# Altium schematic sheet Waistband_motorDrivers.SchDoc
size A; SheetNumber: 2; SheetTotal: 5
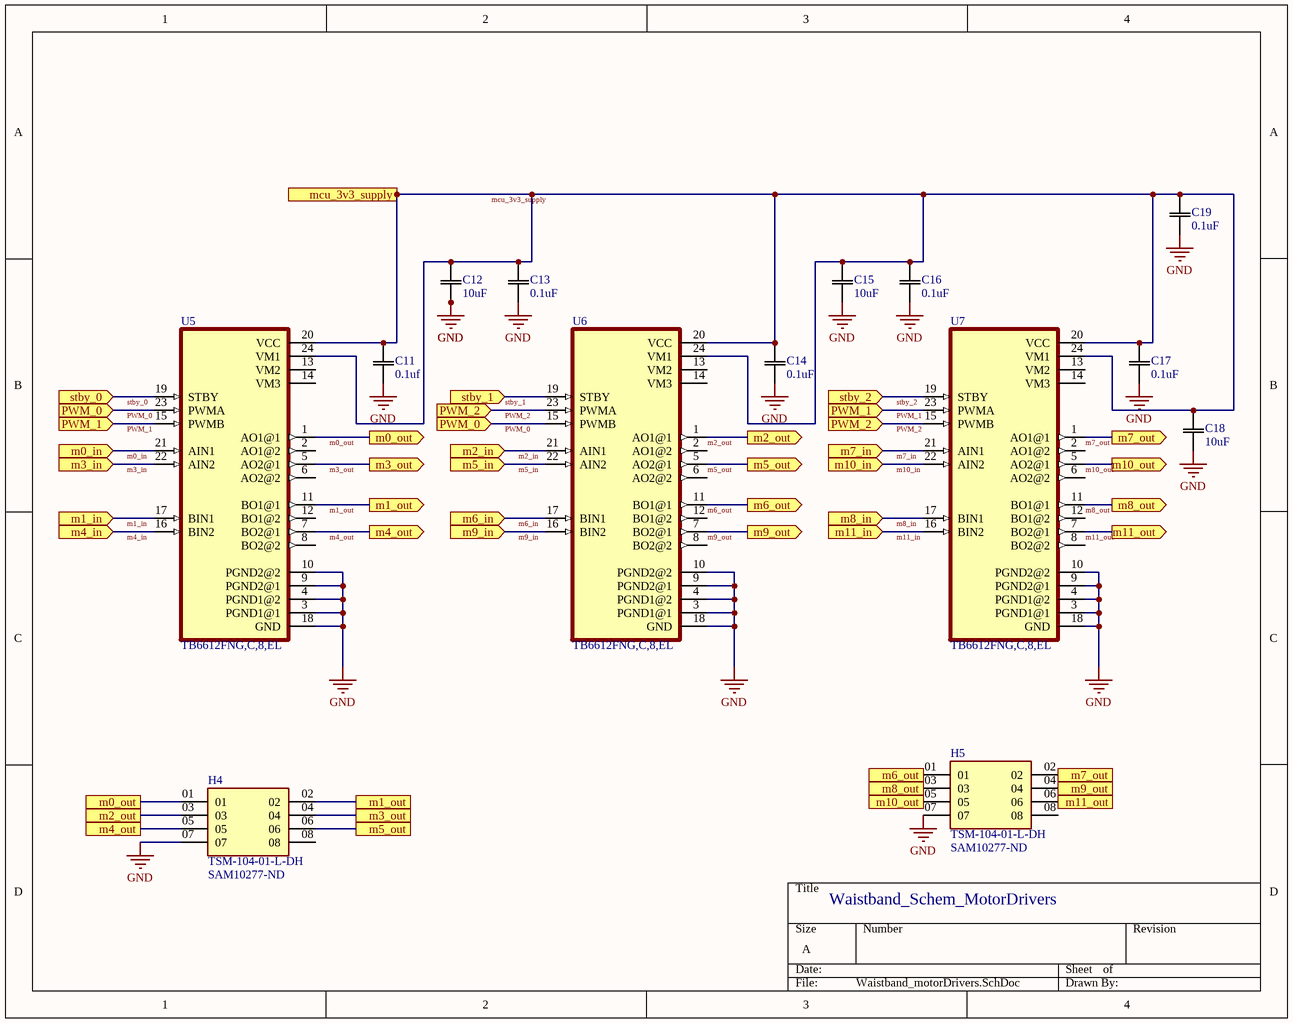
[diagram p0: Waistband_motorDrivers.SchDoc]

## Parts
C11  0.1uf  [Res 0805 1k]
C12  10uF  [C10uF]
C13  0.1uF  [Res 0805 1k]
C14  0.1uF  [Res 0805 1k]
C15  10uF  [C10uF]
C16  0.1uF  [Res 0805 1k]
C17  0.1uF  [Res 0805 1k]
C18  10uF  [C10uF]
C19  0.1uF  [Res 0805 1k]
H4  TSM-104-01-L-DH  [SAM10277-ND]
H5  TSM-104-01-L-DH  [SAM10277-ND]
U5  TB6612FNG,C,8,EL  [motorDriver_pcb]
U6  TB6612FNG,C,8,EL  [motorDriver_pcb]
U7  TB6612FNG,C,8,EL  [motorDriver_pcb]

## Ports
m0_in (in), m0_out, m0_out (out), m1_in (in), m1_out, m1_out (out), m2_in (in), m2_out, m2_out (out), m3_in (in), m3_out, m3_out (out), m4_in (in), m4_out, m4_out (out), m5_in (in), m5_out, m5_out (out), m6_in (in), m6_out, m6_out (out), m7_in (in), m7_out, m7_out (out), m8_in (in), m8_out, m8_out (out), m9_in (in), m9_out, m9_out (out), m10_in (in), m10_out, m10_out (out), m11_in (in), m11_out, m11_out (out), mcu_3v3_supply, PWM_0 (in), PWM_1 (in), PWM_2 (in), stby_0 (in), stby_1 (in), stby_2 (in)

## Nets
GND: C11.1 C12.1 C13.1 C14.1 C15.1 C16.1 C17.1 C18.1 C19.1 H4.07 H5.07 U5.3(PGND1@1) U5.4(PGND1@2) U5.9(PGND2@1) U5.10(PGND2@2) U5.18(GND) U6.3(PGND1@1) U6.4(PGND1@2) U6.9(PGND2@1) U6.10(PGND2@2) U6.18(GND) U7.3(PGND1@1) U7.4(PGND1@2) U7.9(PGND2@1) U7.10(PGND2@2) U7.18(GND)
m0_in: U5.21(AIN1) ; port m0_in
m0_out: H4.01 U5.1(AO1@1) ; port m0_out
m1_in: U5.17(BIN1) ; port m1_in
m1_out: H4.02 U5.11(BO1@1) ; port m1_out
m2_in: U6.21(AIN1) ; port m2_in
m2_out: H4.03 U6.1(AO1@1) ; port m2_out
m3_in: U5.22(AIN2) ; port m3_in
m3_out: H4.04 U5.5(AO2@1) ; port m3_out
m4_in: U5.16(BIN2) ; port m4_in
m4_out: H4.05 U5.7(BO2@1) ; port m4_out
m5_in: U6.22(AIN2) ; port m5_in
m5_out: H4.06 U6.5(AO2@1) ; port m5_out
m6_in: U6.17(BIN1) ; port m6_in
m6_out: H5.01 U6.11(BO1@1) ; port m6_out
m7_in: U7.21(AIN1) ; port m7_in
m7_out: H5.02 U7.1(AO1@1) ; port m7_out
m8_in: U7.17(BIN1) ; port m8_in
m8_out: H5.03 U7.11(BO1@1) ; port m8_out
m9_in: U6.16(BIN2) ; port m9_in
m9_out: H5.04 U6.7(BO2@1) ; port m9_out
m10_in: U7.22(AIN2) ; port m10_in
m10_out: H5.05 U7.5(AO2@1) ; port m10_out
m11_in: U7.16(BIN2) ; port m11_in
m11_out: H5.06 U7.7(BO2@1) ; port m11_out
mcu_3v3_supply: C11.2 C12.2 C13.2 C14.2 C15.2 C16.2 C17.2 C18.2 C19.2 U5.20(VCC) U5.24(VM1) U6.20(VCC) U6.24(VM1) U7.20(VCC) U7.24(VM1) ; port mcu_3v3_supply
PWM_0: U5.23(PWMA) U6.15(PWMB) ; port PWM_0
PWM_1: U5.15(PWMB) U7.23(PWMA) ; port PWM_1
PWM_2: U6.23(PWMA) U7.15(PWMB) ; port PWM_2
stby_0: U5.19(STBY) ; port stby_0
stby_1: U6.19(STBY) ; port stby_1
stby_2: U7.19(STBY) ; port stby_2

Not connected (* = marked no-connect by the designer): H4 08; H5 08; U5 2(AO1@2) 6(AO2@2) 8(BO2@2) 12(BO1@2) 13(VM2) 14(VM3); U6 2(AO1@2) 6(AO2@2) 8(BO2@2) 12(BO1@2) 13(VM2) 14(VM3); U7 2(AO1@2) 6(AO2@2) 8(BO2@2) 12(BO1@2) 13(VM2) 14(VM3)

## Notes on the sheet
- Waistband_Schem_MotorDrivers

## Library data of the parts
C11 C13 C14 C16 C17 C19 = C0805C104M5UACTU: Cap Ceramic 0.1uF 50V Z5U 20% SMD 0805 85C Paper T/R; Manufacturer: KEMET; Capacitance: 100nF; Dissipation Factor: 4%; Supplier 1: Digi-Key; Manufacturer Part Number: C0805C104M5UACTU; RoHS: Yes; Category: Ceramic Capacitors; Stock 1: 106; Pricing 1: 1=0.18000, 10=0.12700, 50=0.07220, 100=0.05980, 500=0.04194, 1000=0.03472 (USD); Mount: Surface Mount,PCB; Case/Package: 0805; Number of Pins: 2; Case Code (Imperial): 0805; Case Code (Metric): 2012; Dielectric Material: Ceramic; Contact Plating: Tin,Matte; Min Operating Temperature: 10°C; Max Operating Temperature: 85°C; Tolerance: 20%; Voltage Rating: 50V; Packaging: Tape and Reel; Package Quantity: 1; Voltage Rating (DC): 50V; Dielectric: Z5U; Termination: SMD/SMT; Series: C; Voltage: 50V; Construction: Flat; Length: 2mm; Width: 1.2mm; Height: 0.78mm; Depth: 1.25mm; Thickness: 0.035inch; Lead Pitch: 0.75mm; Radiation Hardening: No; RoHS Compliant: Yes; REACH SVHC: No SVHC; Lead Free: Lead Free; ComponentLink1URL: https://datasheet.ciiva.com/18193/getdatasheetpartid-89715-18193450.pdf?src-supplier=Verical; ComponentLink1Description: https://datasheet.ciiva.com/18193/getdatasheetpartid-89715-18193450.pdf?src-supplier=Verical; ComponentLink2URL: https://datasheet.ciiva.com/26847/getdatasheetpartid-314452-26847798.pdf?src-supplier=Verical; ComponentLink2Description: https://datasheet.ciiva.com/26847/getdatasheetpartid-314452-26847798.pdf?src-supplier=Verical; ComponentLink3URL: https://datasheet.ciiva.com/7842/kem-c1004-z5u-smd-7842541.pdf?src-supplier=Element14; ComponentLink3Description: https://datasheet.ciiva.com/7842/kem-c1004-z5u-smd-7842541.pdf?src-supplier=Element14; Supplier Part Number 1: 399-C0805C104M5UAC7800CT-ND
C12 C15 C18 = CL21A106KOQNNNE: Ceramic capacitor SMD-0805 10000nF (10uF) /16V X5R# K +-10% Samsung , RoHS/4000pcs/; Tolerance: 10%; Voltage Rating: 16V; Dielectric: X7R; Supplier 1: Digi-Key; Supplier Part Number 1: 1276-1096-1-ND; Manufacturer: Samsung; Manufacturer Part Number: CL21A106KOQNNNE; RoHS: Yes; Category: Ceramic Capacitors; Stock 1: 250843; Pricing 1: 1=0.11000, 10=0.08100, 50=0.04400, 100=0.03600, 500=0.02568, 1000=0.02018 (USD); Mount: Surface Mount; Case/Package: 0805; Case Code (Metric): 2012; Case Code (Imperial): 0805; Min Operating Temperature: -55°C; Max Operating Temperature: 85°C; Package Quantity: 1; Packaging: Tape and Reel; Capacitance: 10uF; Voltage Rating (DC): 16V; Voltage: 16V; Series: CL; Construction: Flat; Length: 2mm; Width: 0.049inch; Height: 1.25mm; Thickness: 0.055inch; Depth: 1.25mm; Radiation Hardening: No; Lead Free: Lead Free; RoHS Compliant: Yes; ComponentLink1URL: https://datasheet.ciiva.com/25798/cl21a106koqnnne-25798133.pdf?src-supplier=Digi-Key; ComponentLink1Description: https://datasheet.ciiva.com/25798/cl21a106koqnnne-25798133.pdf?src-supplier=Digi-Key; ComponentLink2URL: https://datasheet.ciiva.com/15216/getdatasheetpartid-358435-15216234.pdf?src-supplier=Verical; ComponentLink2Description: https://datasheet.ciiva.com/15216/getdatasheetpartid-358435-15216234.pdf?src-supplier=Verical; ComponentLink3URL: https://datasheet.ciiva.com/16740/cl05b104kq5nnnc-16740697.pdf?src-supplier=Future+Electronics; ComponentLink3Description: https://datasheet.ciiva.com/16740/cl05b104kq5nnnc-16740697.pdf?src-supplier=Future+Electronics
H4 H5 = TSM-104-01-L-DH: Conn Unshrouded Header HDR 8 POS 2.54mm Solder RA Side Entry SMD Bulk; Manufacturer: Samtec; Current Rating: 7A; Number of Contacts: 8; Max Voltage Rating (AC): 475V; Gender: Male; Supplier 1: Digi-Key; Manufacturer Part Number: TSM-104-01-L-DH; RoHS: Yes; Category: Headers and Wire Housings; Stock 1: 2054; Pricing 1: 1=1.76000, 10=1.53000, 100=1.36710, 500=1.13924, 1000=0.97650, 5000=0.86800 (USD); Contact Plating: Gold; Contact Material: Bronze; Housing Color: Black; Housing Material: Polymer; Min Operating Temperature: -55°C; Max Operating Temperature: 125°C; Number of Rows: 2; Packaging: Bulk; Max Current Rating: 7A; Termination: Solder; Orientation: Horizontal; Series: TSM; Length: 10.16mm; Pitch: 2.54mm; Depth: 15.09mm; Radiation Hardening: No; REACH SVHC: No SVHC; Lead Free: Lead Free; RoHS Compliant: Yes; ComponentLink1URL: https://datasheet.ciiva.com/25616/0900766b81157e6c-25616892.pdf?src-supplier=RSComponents; ComponentLink1Description: https://datasheet.ciiva.com/25616/0900766b81157e6c-25616892.pdf?src-supplier=RSComponents; Supplier Part Number 1: SAM10277-ND
U5-U7 = TB6612FNG,C,8,EL: DC Motor Driver 2.7V to 5.5V 24-Pin SSOP Embossed T/R; Manufacturer: Toshiba; Number of Outputs: 2; Output Current: 1A; Logic Function: AND GATE; Interface: Parallel; Operating Supply Voltage: 3V; Supplier 1: Digi-Key; Manufacturer Part Number: TB6612FNG,C,8,EL; RoHS: Yes; Category: Motor Drivers; Pricing 1: 1=2.06000, 10=1.85400, 25=1.74880, 100=1.49010, 250=1.39920, 500=1.22430, 1000=1.01442 (USD); Mount: Surface Mount; Case/Package: SSOP; Number of Pins: 24; Min Operating Temperature: -20°C; Max Operating Temperature: 85°C; Package Quantity: 1; Packaging: Tape and Reel; Min Supply Voltage: 2.7V; Max Supply Voltage: 5.5V; Series: -; ComponentLink1URL: https://datasheet.ciiva.com/12216/tb6612fng-datasheet-en-20141001-12216529.pdf?src-supplier=Mouser; ComponentLink1Description: https://datasheet.ciiva.com/12216/tb6612fng-datasheet-en-20141001-12216529.pdf?src-supplier=Mouser